# EasyEDA schematic MCBAC_V2.1.json
TITLE: MCBAC SCHEMATIC; REV: 2.1; Date: 2020-04-06; Sheet: 1/1; Drawn By: WestleyR; Company: MCBAC Designer & Developer
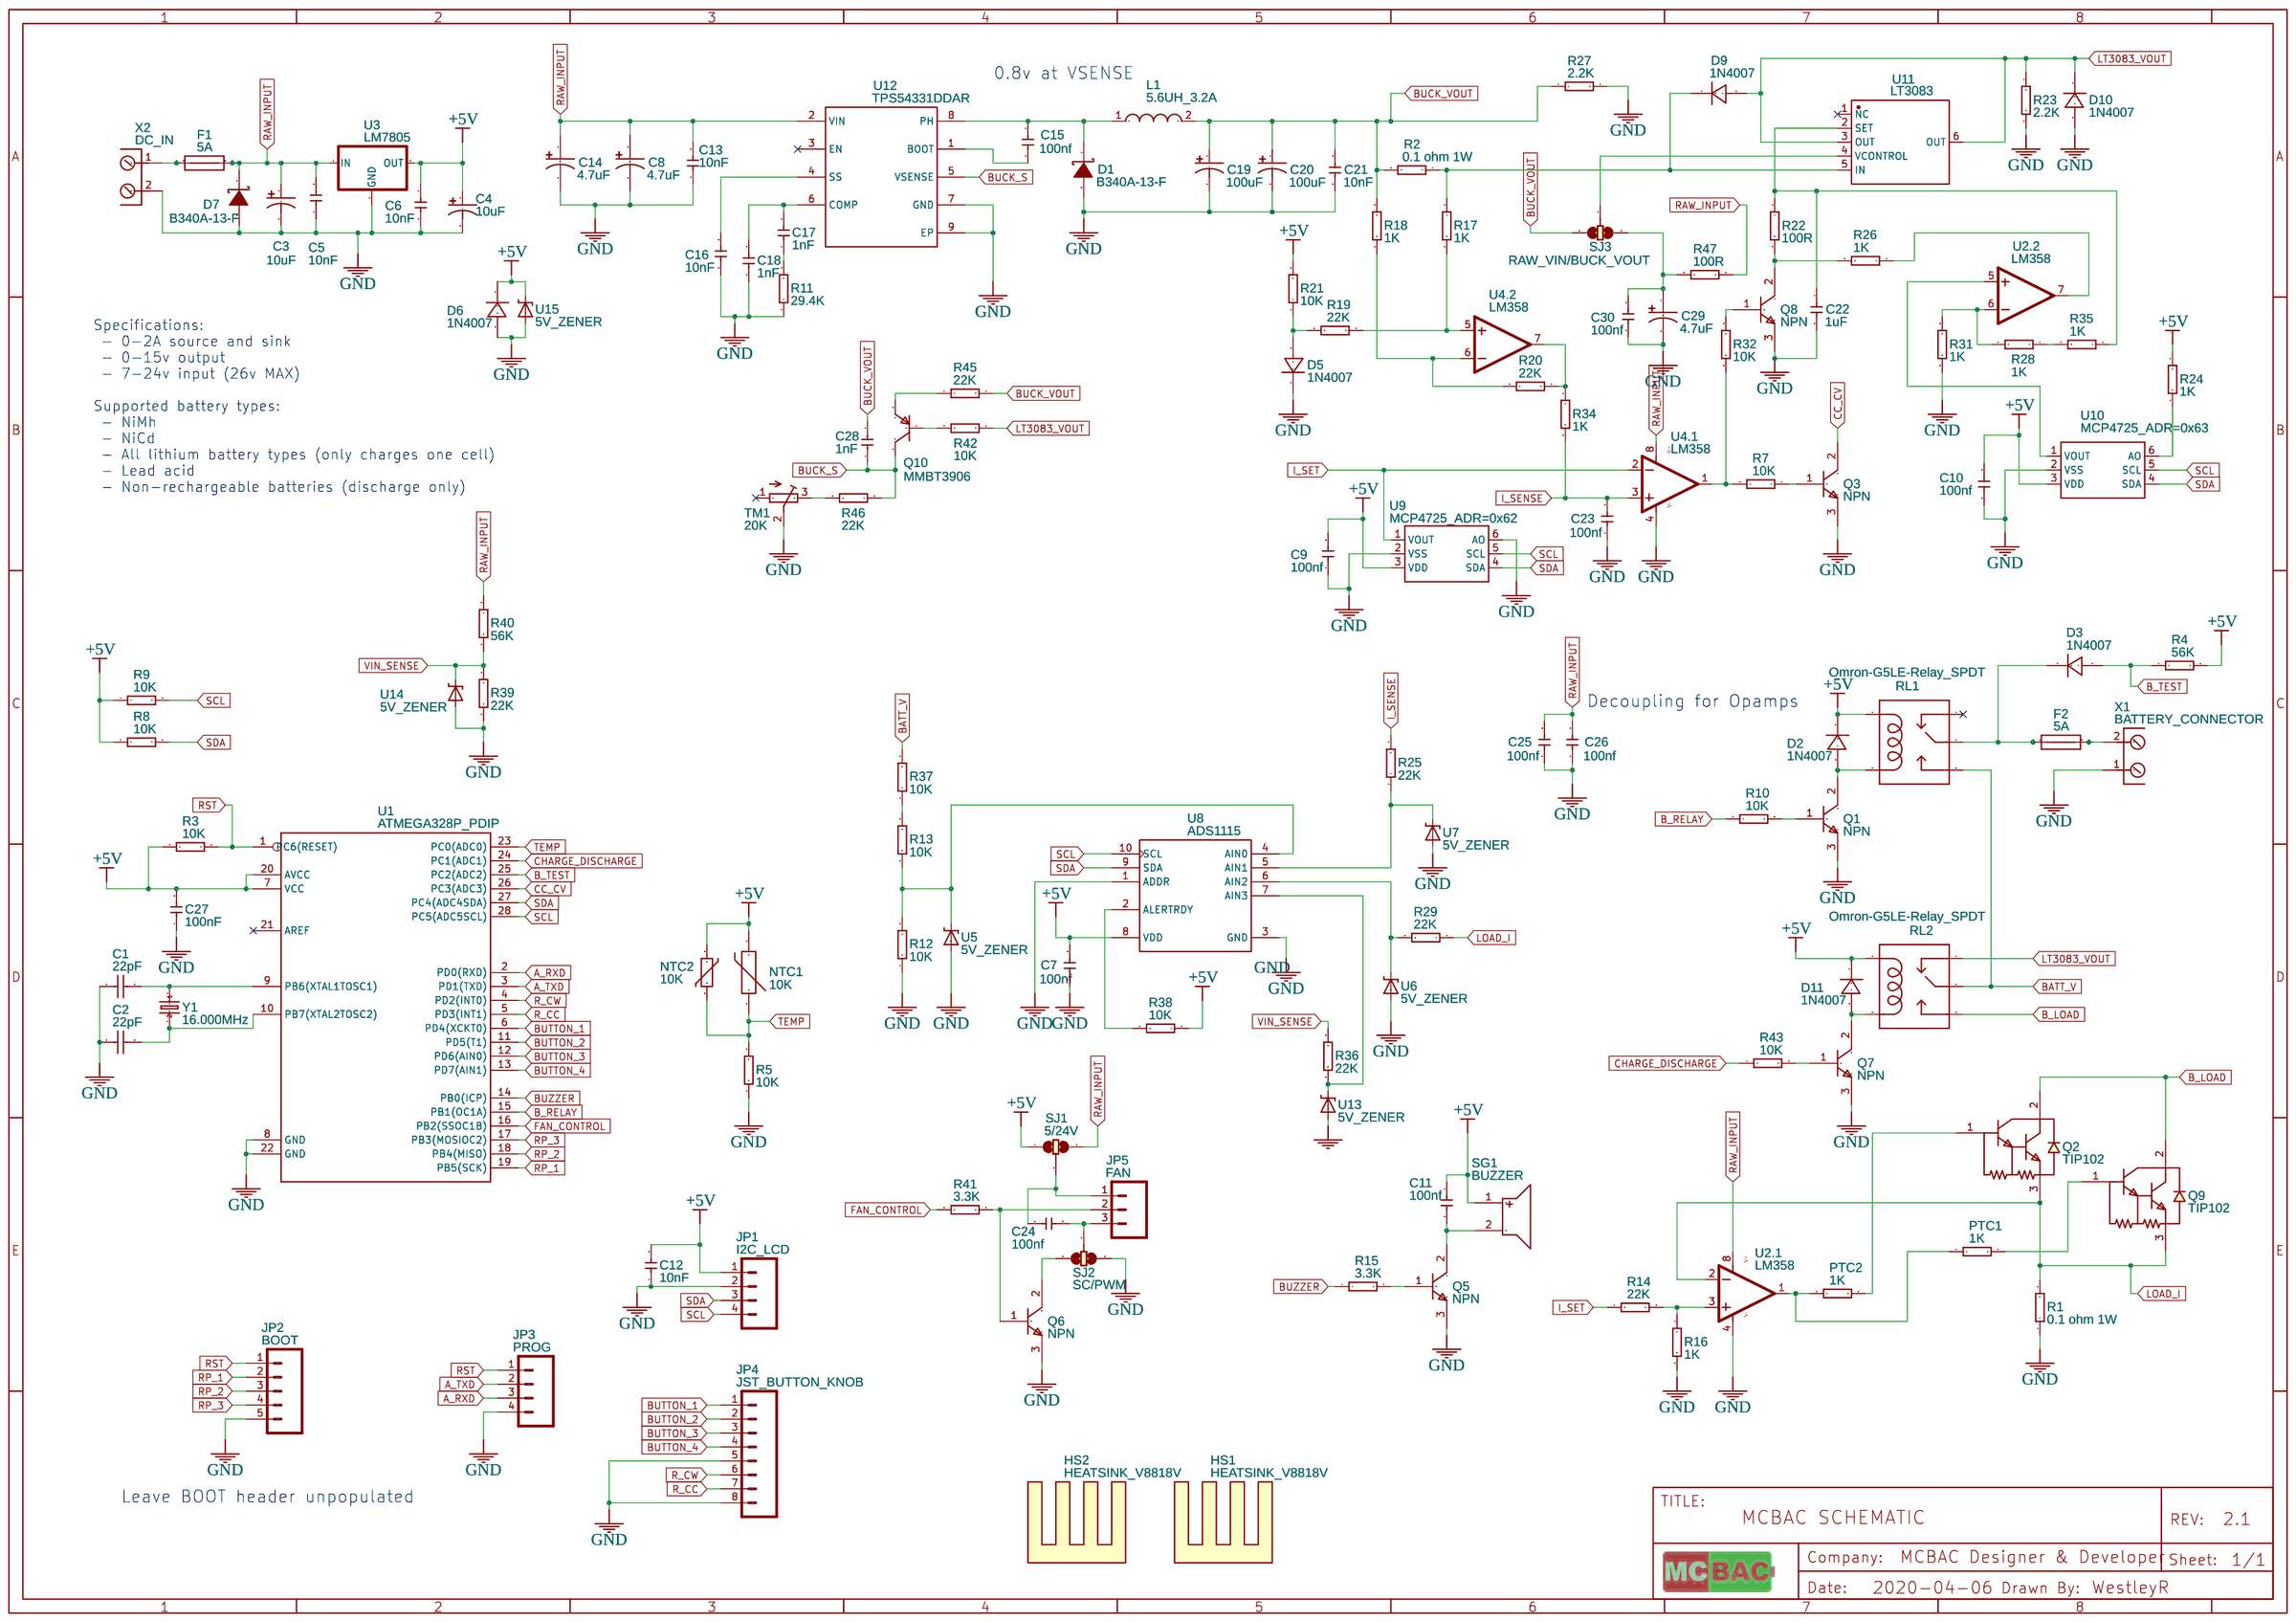
[diagram p0: schematic sheet]

## Parts
C1  22pF  [C0805]
C2  22pF  [C0805]
C3  10uF  [CPOL-RADIAL-100UF-25V]
C4  10uF  [CPOL-RADIAL-100UF-25V]
C5  10nF  [C0805]
C6  10nF  [C0805]
C7  100nf  [C0805]
C8  4.7uF  [CAP-TH_BD5.0-P2.00-D0.8-FD]
C9  100nf  [C0805]
C10  100nf  [C0603]
C11  100nf  [C0805]
C12  10nF  [C0805]
C13  10nF  [C0805]
C14  4.7uF  [CAP-TH_BD5.0-P2.00-D0.8-FD]
C15  100nf  [C0805]
C16  10nF  [C0805]
C17  1nF  [C0805]
C18  1nF  [C0805]
C19  100uF  [CPOL-RADIAL-100UF-25V]
C20  100uF  [CPOL-RADIAL-100UF-25V]
C21  10nF  [C0805]
C22  1uF  [C0805]
C23  100nf  [C0603]
C24  100nf  [C0805]
C25  100nf  [C0805]
C26  100nf  [C0805]
C27  100nF  [C0805]
C28  1nF  [C0805]
C29  4.7uF  [CAP-TH_BD5.0-P2.00-D0.8-FD]
C30  100nf  [C0805]
D1  B340A-13-F  [SMA_L4.4-W2.6-LS5.0-RD]
D2  1N4007  [SMA_L4.4-W2.6-LS5.0-RD]
D3  1N4007  [SMA_L4.4-W2.6-LS5.0-RD]
D5  1N4007  [SMA_L4.4-W2.6-LS5.0-RD]
D6  1N4007  [SMA_L4.4-W2.6-LS5.0-RD]
D7  B340A-13-F  [SMA_L4.4-W2.6-LS5.0-RD]
D9  1N4007  [SMA_L4.4-W2.6-LS5.0-RD]
D10  1N4007  [SMA_L4.4-W2.6-LS5.0-RD]
D11  1N4007  [SMA_L4.4-W2.6-LS5.0-RD]
F1  5A  [FH_5X20]
F2  5A  [FH_5X20]
HS1  HEATSINK_V8818V  [HEATSINK_V8818V]
HS2  HEATSINK_V8818V  [HEATSINK_V8818V]
JP1  I2C_LCD  [PKG-B4B-XH-A(LF)(SN)]
JP2  BOOT  [1X05_LONGPADS]
JP3  PROG  [1X04_LONGPADS]
JP4  JST_BUTTON_KNOB  [PEMC1-8]
JP5  FAN  [1X03_LONGPADS]
L1  5.6UH_3.2A  [5.6UH_3.2A]
NTC1  10K  [LED_STANDOFF]
NTC2  10K  [R0603]
PTC1  1K  [R0402]
PTC2  1K  [R0402]
Q1  NPN  [SOT-23-3_L2.9-W1.6-P1.90-LS2.8-BR-CW]
Q2  TIP102  [TO-220]
Q3  NPN  [SOT-23-3_L2.9-W1.6-P1.90-LS2.8-BR-CW]
Q5  NPN  [SOT-23-3_L2.9-W1.6-P1.90-LS2.8-BR-CW]
Q6  NPN  [SOT-23-3_L2.9-W1.6-P1.90-LS2.8-BR-CW]
Q7  NPN  [SOT-23-3_L2.9-W1.6-P1.90-LS2.8-BR-CW]
Q8  NPN  [SOT-23-3_L2.9-W1.6-P1.90-LS2.8-BR-CW]
Q9  TIP102  [TO-220]
Q10  MMBT3906  [SOT-23-3_L2.9-W1.3-P1.90-LS2.4-BR]
R1  0.1 ohm 1W  [R2512]
R2  0.1 ohm 1W  [R2512]
R3  10K  [R0603]
R4  56K  [R0603]
R5  10K  [R0603]
R7  10K  [R0603]
R8  10K  [R0603]
R9  10K  [R0603]
R10  10K  [R0603]
R11  29.4K  [R0603]
R12  10K  [R0603]
R13  10K  [R0603]
R14  22K  [R0603]
R15  3.3K  [R0603]
R16  1K  [R0603]
R17  1K  [R0603]
R18  1K  [R0603]
R19  22K  [R0603]
R20  22K  [R0603]
R21  10K  [R0603]
R22  100R  [R0603]
R23  2.2K  [R0603]
R24  1K  [R0603]
R25  22K  [R0603]
R26  1K  [R0603]
R27  2.2K  [R0603]
R28  1K  [R0603]
R29  22K  [R0603]
R31  1K  [R0603]
R32  10K  [R0603]
R34  1K  [R0603]
R35  1K  [R0603]
R36  22K  [R0603]
R37  10K  [R0603]
R38  10K  [R0603]
R39  22K  [R0603]
R40  56K  [R0603]
R41  3.3K  [R0603]
R42  10K  [R0603]
R43  10K  [R0603]
R45  22K  [R0603]
R46  22K  [R0603]
R47  100R  [R0603]
RL1  Omron-G5LE-Relay_SPDT  [OMRON_G5LE_SPDT_RELAY]
RL2  Omron-G5LE-Relay_SPDT  [OMRON_G5LE_SPDT_RELAY]
SG1  BUZZER  [DIP-BUZZER-12X7.5]
SJ1  5/24V  [SJ_3_PASTE12]
SJ2  SC/PWM  [SJ_3_PASTE12]
SJ3  RAW_VIN/BUCK_VOUT  [SJ_3_PASTE12]
TM1  20K  [TC33X]
U1  ATMEGA328P_PDIP  [DIL28-3]
U2  LM358  [SOIC-8_L4.9-W3.9-P1.27-LS6.0-BL]  (sections 1,2)
U3  LM7805  [TO-252-3_L6.5-W5.8-P4.58-BR]
U4  LM358  [SOIC-8_L4.9-W3.9-P1.27-LS6.0-BL]  (sections 1,2)
U5  5V_ZENER  [SOD-123FL_L2.7-W1.8-LS3.8-RD]
U6  5V_ZENER  [SOD-123FL_L2.7-W1.8-LS3.8-RD]
U7  5V_ZENER  [SOD-123FL_L2.7-W1.8-LS3.8-RD]
U8  ADS1115  [MSOP10]
U9  MCP4725_ADR=0x62  [SOT23-6]
U10  MCP4725_ADR=0x63  [SOT23-6]
U11  LT3083  [DD-PAK-5_L10.6-W10.3-P1.70-LS14.5-BR]
U12  TPS54331DDAR  [SOIC-8_L5.0-W4.0-P1.27-LS6.0-BL-EP]
U13  5V_ZENER  [SOD-123FL_L2.7-W1.8-LS3.8-RD]
U14  5V_ZENER  [SOD-123FL_L2.7-W1.8-LS3.8-RD]
U15  5V_ZENER  [SOD-123FL_L2.7-W1.8-LS3.8-RD]
X1  BATTERY_CONNECTOR  [2 PIN 5 MM CONNECTOR]
X2  DC_IN  [2 PIN 5 MM CONNECTOR]
Y1  16.000MHz  [HC49/US]

## Library data of the parts
C1 C2 = 22pF: Supplier Part: undefined; Supplier: LCSC; Manufacturer: LCSC; Manufacturer Part: 22K-50V
C3 C4 C19 C20 = 100UF-25V-20%(PTH): CAP-08439; Contributor: SparkFun
C5-C7 C9-C13 C15-C18 C21-C28 C30 = DIP-CERAMIC-22PF-100V-5%-NPO(D5.0MM): Manufacturer Part: ?
C8 C14 C29 = 4.7uF 100V 5*11: Supplier: LCSC; Supplier Part: C10741; Manufacturer: Made in China; Contributor: LCSC
D1 D7 = B340A-13-F: Supplier: LCSC; Manufacturer: DIODES; Supplier Part: C85098; LCSC Assembly: Yes; SMT Type: Extend
D2 D3 D5 D6 D9-D11 = 1N4007: Contributor: andyfierman; sourceId: i60Uc6M3X; link: http://www.onsemi.com/PowerSolutions/product.do?id=1N4007; sim: true
F1 F2 = FH_5X20
HS1 HS2 = HEATSINK_V8818V: Contributor: WestleyR; license: https://www.gnu.org/licenses/lgpl-2.1.html; link: http://www.assmann-wsw.com/fileadmin/datasheets/ASS_0873_HS.pdf
JP1 JP3 = M04LONGPADS: Header 4; Contributor: SparkFun
JP2 = M05: Contributor: SparkFun
JP4 = M08LONGPADS: Header 8; Contributor: SparkFun
JP5 = M03: Contributor: SparkFun
L1 = 5.6UH_3.2A: Contributor: WestleyR; Manufacturer Part: SDE0604A-5R6M; Supplier: Digi-Key; Supplier Part: SDE0604A-5R6MCT-ND; Manufacturer: Bourns Inc.; link: https://www.digikey.com/product-detail/en/bourns-inc/SDE0604A-5R6M/SDE0604A-5R6MCT-ND/5031070
NTC1 = FM72-5D11: Supplier Part: undefined; Supplier: LCSC; Manufacturer: RUILON
NTC2 = VARISTOR0402: VARISTOR; Contributor: Pinoccio
PTC1 PTC2 R3-R5 R7-R29 R31 R32 R34-R43 R45-R47 = RESISTOR: Contributor: DangerousPrototype
Q1 Q3 Q5-Q8 = P2N2222ARL1G: Amplifier Transistor, NPN Silicon, 3-Pin TO-92, Pb-Free, Tape and Reel
Q2 Q9 = TIP102G: Plastic Medium-Power, Complementary Silicon Transistor, 3-Pin TO-220, Pb-Free, Tube
Q10 = MMBT3906_C163253: Supplier Part: C163253; Supplier: LCSC; Manufacturer: FMS; Contributor: 立创EDA官方封装库; LCSC Assembly: Yes; SMT Type: Extend
R1 R2 = 1W RESISTOR: Contributor: DangerousPrototype
RL1 RL2 = Omron-G5LE-Relay_SPDT: sourceId: Wgs2ZXjTR
SG1 = BUZZER-7.5mm: Supplier Part: C96094; Supplier: LCSC; Manufacturer: HNDZ; Manufacturer Part: buzzerHMB1275-12B; Contributor: felixzhdanov
SJ1-SJ3 = SOLDERJUMPER_2WAYPASTE12: Solder Jumper; Contributor: SparkFun
TM1 = TRIMPOTTC33X: SMT trimmer potentiometer part number TC33X; Contributor: Adafruit
U1 = ATMEGA328P_PDIP: Contributor: SparkFun
U2 U4 = LM358: Contributor: SparkFun; subpart_no: 1
U3 = 7805
U5-U7 U13-U15 = DIODE-ZENER: Contributor: SparkFun
U8 = ADS1115QDGSRQ1: Automotive Catalog 16-Bit ADC with Integrated Multiplexer, PGA, Comparator, Oscillator, and Reference, -40 to 125 degC, 10-pin SOP (DGS10), Green (RoHS  no SbBr)
U9 U10 = MCP4725SOT-23: Microchip 12-bit I2C DAC, SOT23-6; Contributor: SparkFun
U11 = LT3083EQ#PBF: Supplier: LCSC; Supplier Part: C459910; Manufacturer: Linear Tech; Contributor: LCSC
U12 = TPS54331DDAR: Supplier: LCSC; Manufacturer: TI; Contributor: LCSC; Supplier Part: C90761; LCSC Assembly: Yes; SMT Type: Extend
X1 X2 = 2 Pin Connector 5mm
Y1 = HC-49US    16.000MHz: DIP Crystal 16MHz-18pF-30ppm-40R;

## Nets
+5V: C4.1(+) C6.2 C7.2 C9.2 C10.2 C11.1 C12.2 C27.2 D2.1(C) D6.1(C) D11.1(C) JP1.1 NTC1.1 NTC2.1 R3.1 R4.2 R8.1 R9.1 R21.2 R24.1 R38.1 RL1.2(COIL2) RL2.2(COIL2) SG1.1 SJ1.1 U1.7(VCC) U1.20(AVCC) U3.2(OUT) U8.8(VDD) U9.3(VDD) U10.3(VDD) U15.1(C)
GND: C1.1 C2.1 C3.2(-) C4.2(-) C5.1 C6.1 C7.1 C8.2 C9.1 C10.1 C12.1 C13.1 C14.2 C16.1 C18.1 C19.2(-) C20.2(-) C21.2 C22.2 C23.1 C25.1 C26.1 C27.1 C29.2 C30.1 D1.2(A) D5.1(C) D6.2(A) D7.2(A) D10.2(A) JP1.2 JP2.5 JP3.4 JP4.5 JP4.8 Q1.3(E) Q3.3(E) Q5.3(E) Q6.3(E) Q7.3(E) Q8.3(E) R1.1 R5.1 R11.1 R12.1 R16.2 R23.2 R27.2 R31.2 R39.1 SJ2.1 TM1.2(S) U1.8(GND) U1.22(GND) U2.4(V-) U3.1(GND) U4.4(V-) U5.2(A) U6.2(A) U7.2(A) U8.1(ADDR) U8.3(GND) U9.2(VSS) U9.6(AO) U10.2(VSS) U12.7(GND) U12.9(EP) U13.2(A) U14.2(A) U15.2(A) X1.1 X2.2
VIN_SENSE: R36.2 R39.2 R40.1 U14.1(C)
A_RXD: JP3.3 U1.2(PD0(RXD))
A_TXD: JP3.2 U1.3(PD1(TXD))
B_LOAD: Q2.2(C) Q9.2(C) RL2.3(NO)
B_RELAY: R10.1 U1.15(PB1(OC1A))
B_TEST: D3.2(A) R4.1 U1.25(PC2(ADC2))
BATT_V: R37.2 RL1.3(NO) RL2.1(MAIN)
BUCK_S: C28.1 Q10.3(C) R46.1 U12.5(VSENSE)
BUCK_VOUT: C19.1(+) C20.1(+) C21.1 C28.2 L1.2 R2.2 R18.2 R27.1 R45.2 SJ3.3
BUTTON_1: JP4.1 U1.6(PD4(XCKT0))
BUTTON_2: JP4.2 U1.11(PD5(T1))
BUTTON_3: JP4.3 U1.12(PD6(AIN0))
BUTTON_4: JP4.4 U1.13(PD7(AIN1))
BUZZER: R15.1 U1.14(PB0(ICP))
CC_CV: Q3.2(C) U1.26(PC3(ADC3))
CHARGE_DISCHARGE: R43.1 U1.24(PC1(ADC1))
FAN_CONTROL: R41.2 U1.16(PB2(SSOC1B))
I_SENSE: C23.2 R25.2 R34.2 U4.3(+IN)
I_SET: R14.1 U4.2(-IN) U9.1(VOUT)
LOAD_I: Q2.3(E) Q9.3(E) R1.2 R29.1 U2.2(-IN)
LT3083_VOUT: D9.2(A) D10.1(C) R23.1 R42.1 RL2.4(NC) U11.3(OUT) U11.6(OUT)
R_CC: JP4.7 U1.5(PD3(INT1))
R_CW: JP4.6 U1.4(PD2(INT0))
RAW_INPUT: C3.1(+) C5.2 C8.1 C13.2 C14.1 C25.2 C26.2 D7.1(K) F1.2A F1.2B R40.2 R47.1 SJ1.3 U2.8(V+) U3.3(IN) U4.8(V+) U12.2(VIN)
RP_1: JP2.2 U1.19(PB5(SCK))
RP_2: JP2.3 U1.18(PB4(MISO))
RP_3: JP2.4 U1.17(PB3(MOSIOC2))
RST: JP2.1 JP3.1 R3.2 U1.1(PC6(RESET))
SCL: JP1.4 R9.2 U1.28(PC5(ADC5SCL)) U8.10(SCL) U9.5(SCL) U10.5(SCL)
SDA: JP1.3 R8.2 U1.27(PC4(ADC4SDA)) U8.9(SDA) U9.4(SDA) U10.4(SDA)
TEMP: NTC1.2 NTC2.2 R5.2 U1.23(PC0(ADC0))
Net-(C1-2): C1.2 U1.9(PB6(XTAL1TOSC1)) Y1.1
Net-(C2-2): C2.2 U1.10(PB7(XTAL2TOSC2)) Y1.2
Net-(C11-2): C11.2 Q5.2(C) SG1.2
Net-(C15-1): C15.1 U12.1(BOOT)
Net-(C15-2): C15.2 D1.1(K) L1.1 U12.8(PH)
Net-(C16-2): C16.2 U12.4(SS)
Net-(C17-1): C17.1 R11.2
Net-(C17-2): C17.2 C18.2 U12.6(COMP)
Net-(C22-1): C22.1 R22.1 R35.1 U11.2(SET)
Net-(C24-1): C24.1 JP5.3 SJ2.2
Net-(C24-2): C24.2 JP5.1 SJ1.2
Net-(C29-1): C29.1 C30.2 R47.2 SJ3.1
Net-(D2-2): D2.2(A) Q1.2(C) RL1.5(COIL1)
Net-(D3-1): D3.1(C) F2.1A F2.1B RL1.1(MAIN)
Net-(D5-2): D5.2(A) R19.1 R21.1
Net-(D9-1): D9.1(C) R2.1 R17.1 U11.5(IN)
Net-(D11-2): D11.2(A) Q7.2(C) RL2.5(COIL1)
Net-(F1-1A): F1.1A F1.1B X2.1
Net-(F2-2A): F2.2A F2.2B X1.2
Net-(JP5-2): JP5.2 Q6.1(B) R41.1
Net-(PTC1-1): PTC1.1 PTC2.1 U2.1(OUT)
Net-(PTC1-2): PTC1.2 Q9.1(B)
Net-(PTC2-2): PTC2.2 Q2.1(B)
Net-(Q1-1): Q1.1(B) R10.2
Net-(Q3-1): Q3.1(B) R7.1
Net-(Q5-1): Q5.1(B) R15.2
Net-(Q6-2): Q6.2(C) SJ2.3
Net-(Q7-1): Q7.1(B) R43.2
Net-(Q8-1): Q8.1(B) R32.2
Net-(Q8-2): Q8.2(C) R22.2 R26.2
Net-(Q10-1): Q10.1(B) R42.2
Net-(Q10-2): Q10.2(E) R45.1
Net-(R7-2): R7.2 R32.1 U4.1(OUT)
Net-(R12-2): R12.2 R13.1 U5.1(C) U8.4(AIN0)
Net-(R13-2): R13.2 R37.1
Net-(R14-2): R14.2 R16.1 U2.3(+IN)
Net-(R17-2): R17.2 R19.2 U4.5(+IN)
Net-(R18-1): R18.1 R20.2 U4.6(-IN)
Net-(R20-1): R20.1 R34.1 U4.7(OUT)
Net-(R24-2): R24.2 U10.6(AO)
Net-(R25-1): R25.1 U7.1(C) U8.5(AIN1)
Net-(R26-1): R26.1 U2.7(OUT)
Net-(R28-1): R28.1 R35.2
Net-(R28-2): R28.2 R31.1 U2.6(-IN)
Net-(R29-2): R29.2 U6.1(C) U8.6(AIN2)
Net-(R36-1): R36.1 U8.7(AIN3) U13.1(C)
Net-(R38-2): R38.2 U8.2(ALERTRDY)
Net-(R46-2): R46.2 TM1.3(E)
Net-(SJ3-2): SJ3.2 U11.4(VCONTROL)
Net-(U2.2-5): U2.5(+IN) U10.1(VOUT)

Not connected (* = marked no-connect by the designer): RL1 4(NC)*; TM1 1(A)*; U1 21(AREF)*; U11 1(NC)*; U12 3(EN)*

## Notes on the sheet
- 0.8v at VSENSE
- Specifications:
   - 0-2A source and sink
   - 0-15v output
   - 7-24v input (26v MAX)
  Supported battery types:
   - NiMh
   - NiCd
   - All lithium battery types (only charges one cell)
   - Lead acid
   - Non-rechargeable batteries (discharge only)
- Decoupling for Opamps
- Leave BOOT header unpopulated
